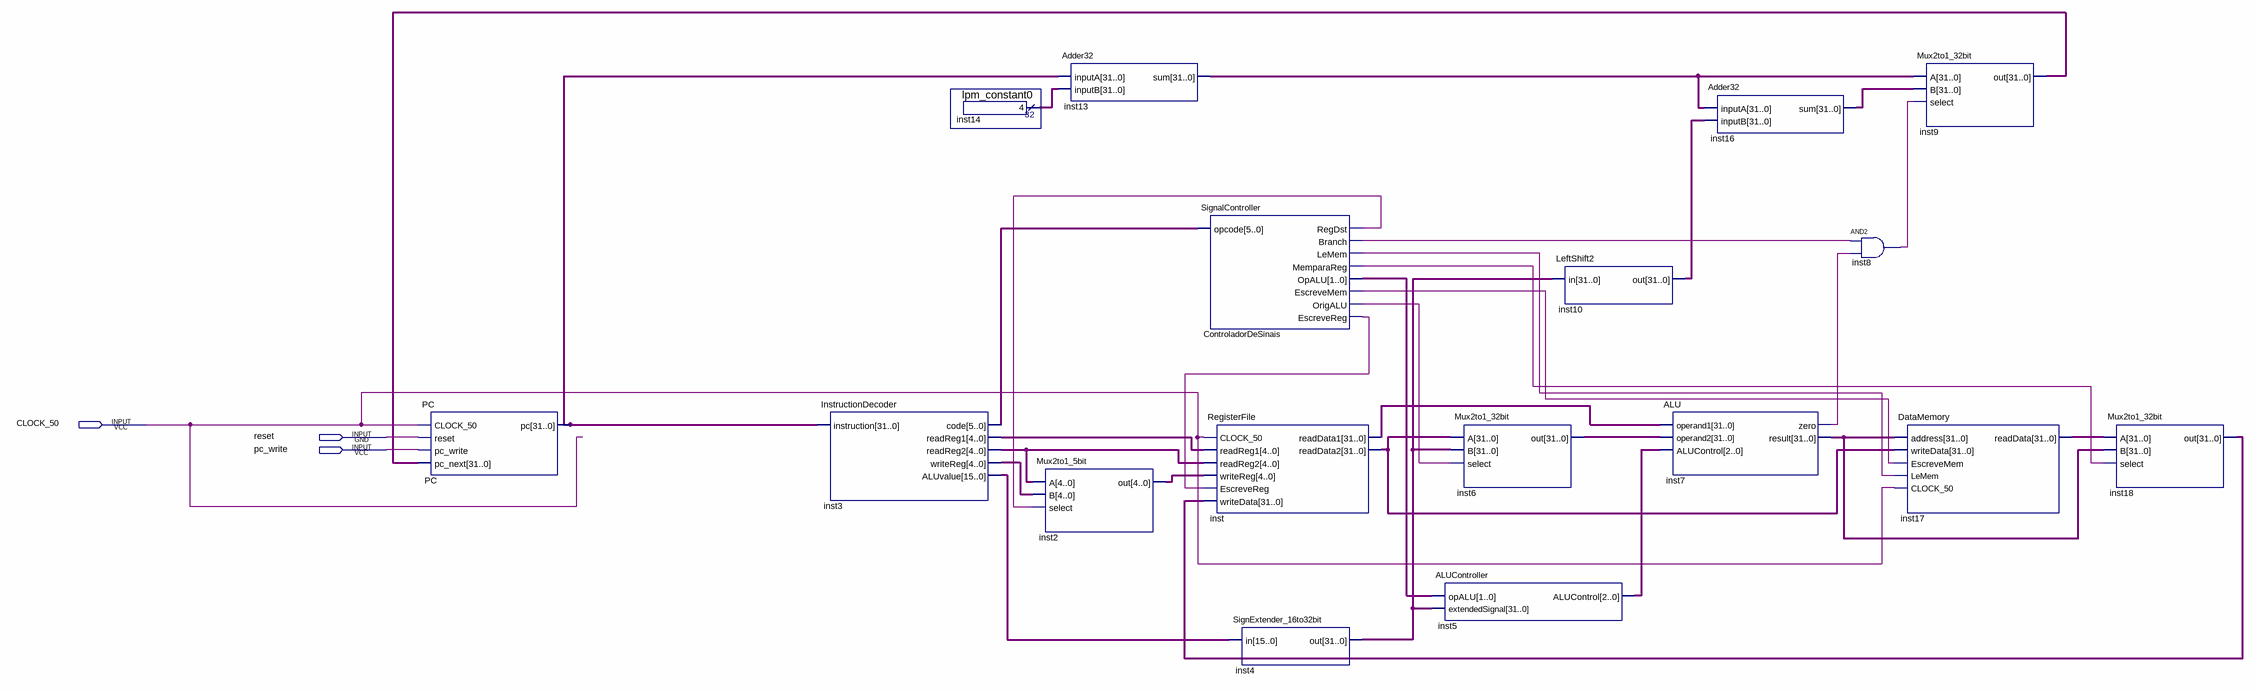
[diagram p0: schematic sheet]
// Quartus schematic Lab2.bdf as structural Verilog: 17 symbols, 3 pins
module Lab2 (
  input  CLOCK_50,
  input  reset,
  input  pc_write
);

  wire ControladorDeSinais_branch, ControladorDeSinais_escrevemem, ControladorDeSinais_escrevereg,
       ControladorDeSinais_lemem, ControladorDeSinais_memparareg, ControladorDeSinais_origalu,
       ControladorDeSinais_regdst, inst7_zero, inst8_out;
  wire [1:0] ControladorDeSinais_opalu;
  wire [2:0] inst5_alucontrol;
  wire [4:0] inst2_out, inst3_readreg1, inst3_readreg2, inst3_writereg;
  wire [5:0] inst3_code;
  wire [15:0] inst3_aluvalue;
  wire [31:0] inst4_out, inst6_out, inst7_result, inst9_out, inst10_out, inst13_sum, inst14_result,
       inst16_sum, inst17_readdata, inst18_out, inst_readdata1, inst_readdata2, PC_pc;

  PC PC (.CLOCK_50(CLOCK_50), .reset(reset), .pc_write(pc_write), .pc_next(inst9_out), .pc(PC_pc));
  InstructionDecoder inst3 (
    .instruction(PC_pc), .code(inst3_code), .readReg1(inst3_readreg1), .readReg2(inst3_readreg2),
    .writeReg(inst3_writereg), .ALUvalue(inst3_aluvalue));
  lpm_constant0 inst14 (.result(inst14_result));
  Adder32 inst13 (.inputA(PC_pc), .inputB(inst14_result), .sum(inst13_sum));
  Mux2to1_5bit inst2 (.A(inst3_readreg2), .B(inst3_writereg), .select(ControladorDeSinais_regdst), .out(inst2_out));
  SignalController ControladorDeSinais (
    .opcode(inst3_code), .RegDst(ControladorDeSinais_regdst), .Branch(ControladorDeSinais_branch),
    .LeMem(ControladorDeSinais_lemem), .MemparaReg(ControladorDeSinais_memparareg),
    .OpALU(ControladorDeSinais_opalu), .EscreveMem(ControladorDeSinais_escrevemem),
    .OrigALU(ControladorDeSinais_origalu), .EscreveReg(ControladorDeSinais_escrevereg));
  RegisterFile inst (
    .CLOCK_50(CLOCK_50), .readReg1(inst3_readreg1), .readReg2(inst3_readreg2), .writeReg(inst2_out),
    .EscreveReg(ControladorDeSinais_escrevereg), .writeData(inst18_out), .readData1(inst_readdata1),
    .readData2(inst_readdata2));
  SignExtender_16to32bit inst4 (.in(inst3_aluvalue), .out(inst4_out));
  Mux2to1_32bit inst6 (.A(inst_readdata2), .B(inst4_out), .select(ControladorDeSinais_origalu), .out(inst6_out));
  ALUController inst5 (.opALU(ControladorDeSinais_opalu), .extendedSignal(inst4_out), .ALUControl(inst5_alucontrol));
  LeftShift2 inst10 (.in(inst4_out), .out(inst10_out));
  ALU inst7 (
    .operand1(inst_readdata1), .operand2(inst6_out), .ALUControl(inst5_alucontrol), .zero(inst7_zero),
    .result(inst7_result));
  Adder32 inst16 (.inputA(inst13_sum), .inputB(inst10_out), .sum(inst16_sum));
  and inst8 (inst8_out, ControladorDeSinais_branch, inst7_zero);
  Mux2to1_32bit inst9 (.A(inst13_sum), .B(inst16_sum), .select(inst8_out), .out(inst9_out));
  DataMemory inst17 (
    .address(inst7_result), .writeData(inst_readdata2), .EscreveMem(ControladorDeSinais_escrevemem),
    .LeMem(ControladorDeSinais_lemem), .CLOCK_50(CLOCK_50), .readData(inst17_readdata));
  Mux2to1_32bit inst18 (
    .A(inst17_readdata), .B(inst7_result), .select(ControladorDeSinais_memparareg), .out(inst18_out));
endmodule
